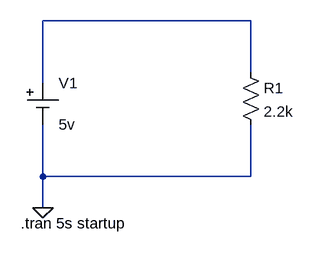
[diagram p0: schematic schematic_for_testing_current.asc]
schematic_for_testing_current.asc, the LTspice schematic file:
Version 4
SHEET 1 880 680
WIRE 464 64 144 64
WIRE 464 144 464 64
WIRE 144 160 144 64
WIRE 144 304 144 224
WIRE 464 304 464 224
WIRE 464 304 144 304
WIRE 144 352 144 304
FLAG 144 352 0
SYMBOL res 448 128 R0
SYMATTR InstName R1
SYMATTR Value 2.2k
SYMBOL Misc\\cell 144 160 R0
WINDOW 123 0 0 Left 0
WINDOW 39 0 0 Left 0
SYMATTR InstName V1
SYMATTR Value 5v
TEXT 110 376 Left 2 !.tran 5s startup

The netlist it stands for:
* schematic_for_testing_current.asc
R1 N001 0 2.2k
V1 N001 0 5v
.tran 5s startup
.backanno
.end